# EAGLE design Warmie Helper Board V.9 (EAGLE 6.4)
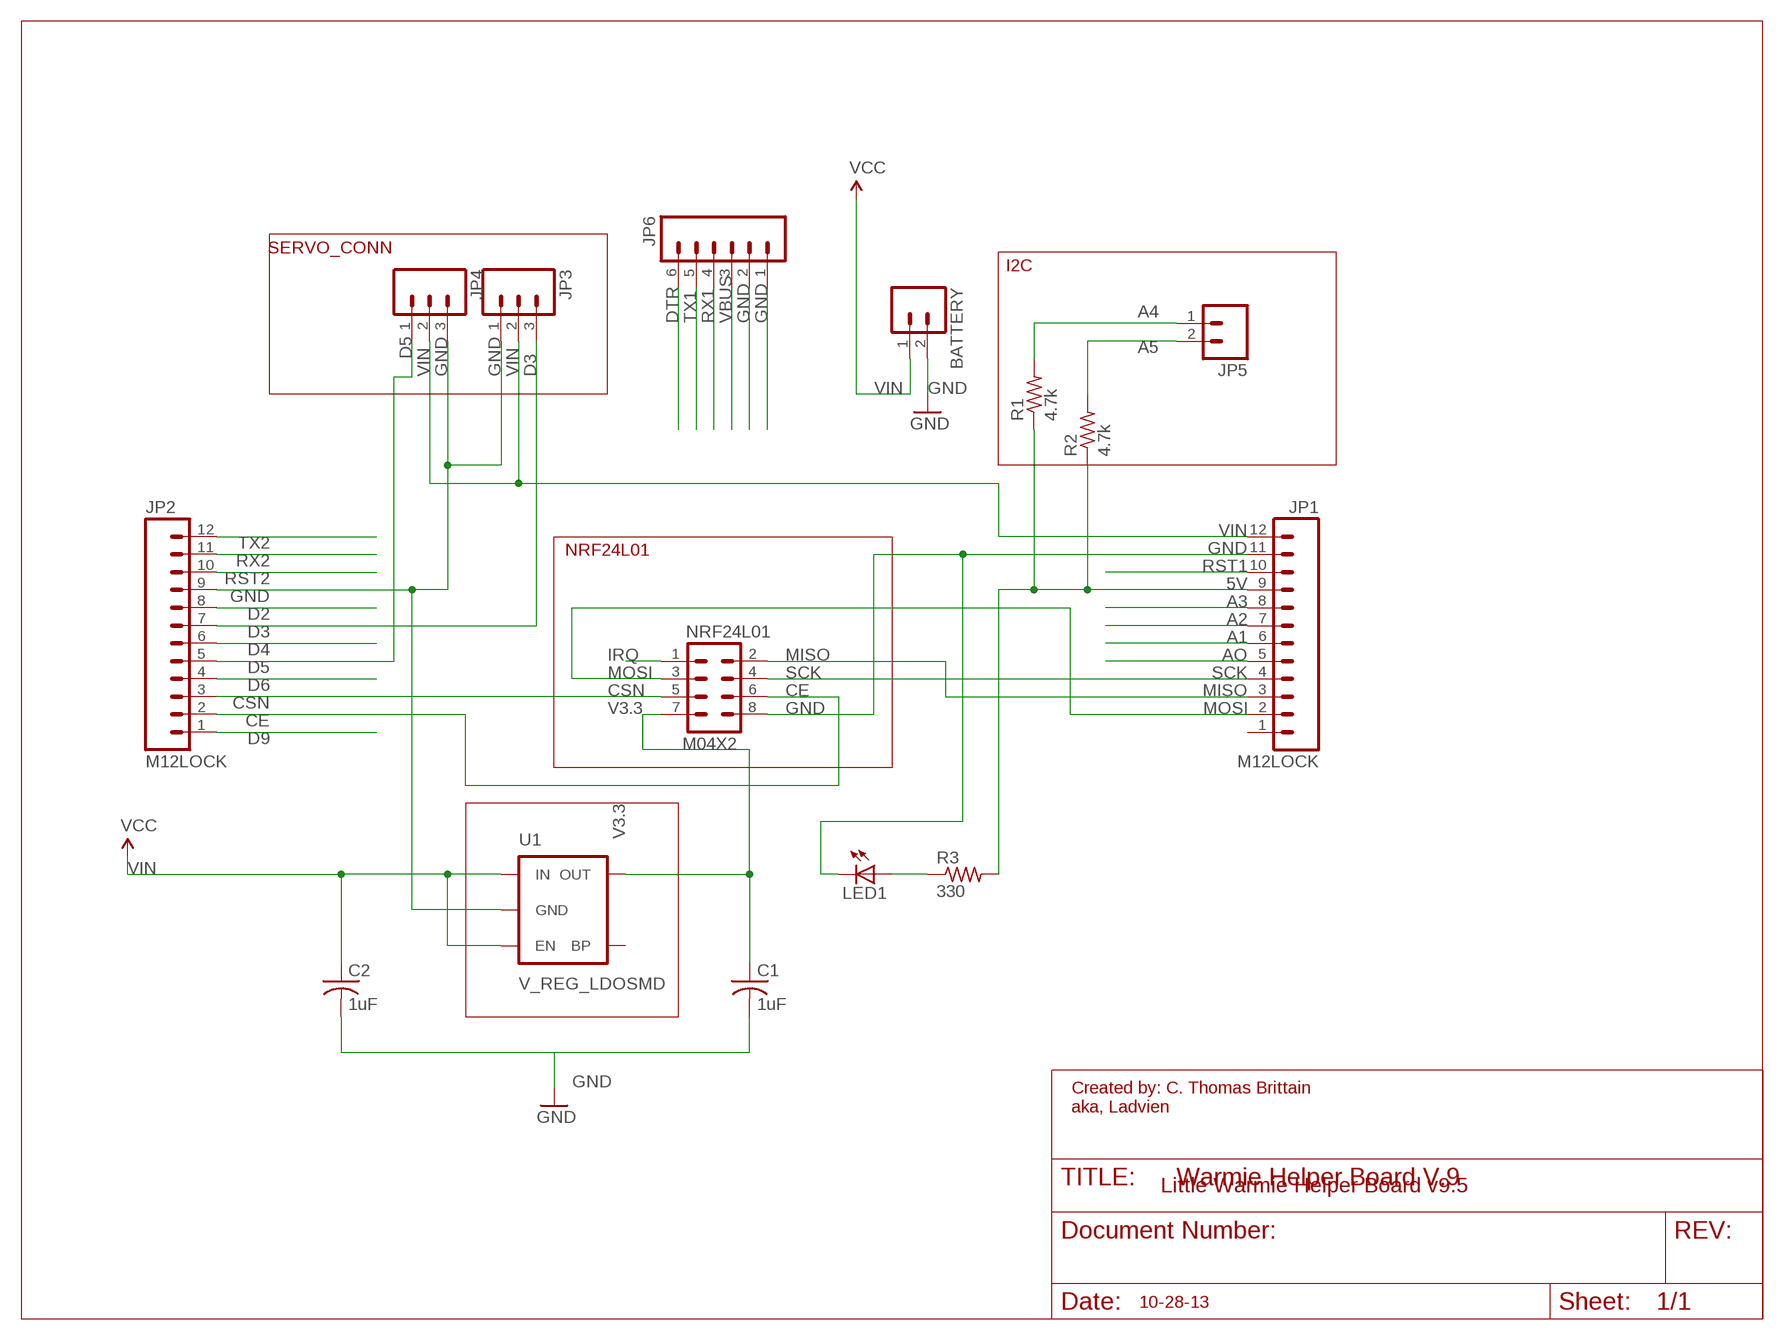
[diagram p0: schematic, sheet 1]

## Parts
BATTERY  M02LOCK  [1X02_LOCK]
C1  1uF  C-USC0805  [C0805]
C2  1uF  C-USC0805  [C0805]
JP1  M12LOCK  [1X12_LOCK]
JP2  M12LOCK  [1X12_LOCK]
JP3  M03LOCK  [1X03_LOCK]
JP4  M03LOCK  [1X03_LOCK]
JP5  M02LOCK  [1X02_LOCK]
JP6  M06LOCK  [1X06_LOCK]
LED1  LEDSML0603  [SML0603]
NRF24L01  M04X2  [2X4]
R1  4.7k  R-US_M0805  [M0805]
R2  4.7k  R-US_M0805  [M0805]
R3  330  R-US_M0805  [M0805]
U1  V_REG_LDOSMD  [SOT23-5]

## Nets
5V: JP1.9 R1.1 R2.1 R3.2
A1: JP1.6
A2: JP1.7
A3: JP1.8
A4: JP5.1 R1.2
A5: JP5.2 R2.2
AO: JP1.5
CE: JP2.2 NRF24L01.6
CSN: JP2.3 NRF24L01.5
D2: JP2.8
D3: JP2.7 JP3.3
D4: JP2.6
D5: JP2.5 JP4.1
D6: JP2.4
D9: JP2.1
DTR: JP6.6
GND: BATTERY.2 C1.2 C2.2 JP1.11 JP2.9 JP3.1 JP4.3 JP6.1 JP6.2 LED1.C NRF24L01.8 U1.2(GND)
IRQ: NRF24L01.1
MISO: JP1.3 NRF24L01.2
MOSI: JP1.2 NRF24L01.3
N$2: LED1.A R3.1
RST1: JP1.10
RST2: JP2.10
RX1: JP6.4
RX2: JP2.11
SCK: JP1.4 NRF24L01.4
TX1: JP6.5
TX2: JP2.12
V3.3: C1.1 NRF24L01.7 U1.5(OUT)
VBUS: JP6.3
VIN: BATTERY.1 C2.1 JP1.12 JP3.2 JP4.2 U1.1(IN) U1.3(EN) ; supply symbol labelled VCC
Unconnected: JP1.1 U1.4(BP)

## Notes on the sheet
- SERVO_CONN
- I2C
- NRF24L01
- Created by: C. Thomas Brittain
  aka, Ladvien
- Little Warmie Helper Board v9.5
- 10-28-13

## Library data of the parts
BATTERY JP5 = SparkFun:M02: Header 2 Standard 2-pin 0.1" header. Use with straight break away headers (SKU : PRT-00116), right angle break away headers (PRT-00553), swiss pins (PRT-00743), machine pins (PRT-00117), and female headers (PRT-00115). Molex polarized connector foot print use with SKU : PRT-08233 with associated crimp pins and housings.
C1 C2 = resistor:C-US: CAPACITOR, American symbol
JP1 JP2 = SparkFun:M12: Header 12 Standard 12-pin 0.1" header. Use with straight break away headers (SKU : PRT-00116), right angle break away headers (PRT-00553), swiss pins (PRT-00743), machine pins (PRT-00117), and female headers (PRT-00115).
JP3 JP4 = SparkFun:M03: Header 3 Standard 3-pin 0.1" header. Use with straight break away headers (SKU : PRT-00116), right angle break away headers (PRT-00553), swiss pins (PRT-00743), machine pins (PRT-00117), and female headers (PRT-00115). Molex polarized connector foot print use with SKU : PRT-08232 with associated crimp pins and housings.
JP6 = SparkFun:M06: Header 6 Standard 6-pin 0.1" header. Use with straight break away headers (SKU : PRT-00116), right angle break away headers (PRT-00553), swiss pins (PRT-00743), machine pins (PRT-00117), and female headers (PRT-00115). Molex polarized connector foot print use with SKU : PRT-08094 with associated crimp pins and housings. NOTES ON THE VARIANTS LOCK and LOCK_LONGPADS... This footprint was designed to help hold the alignment of a through-hole component (i.e. 6-pin header) while soldering it into place. You may notice that each hole has been shifted either up or down by 0.005 of an inch from it's more standard position (which is a perfectly straight line). This slight alteration caused the pins (the squares in the middle) to touch the edges of the holes. Because they are alternating, it causes a "brace" to hold the component in place. 0.005 has proven to be the perfect amount of "off-center" position when using our standard breakaway headers. Although looks a little odd when you look at the bare footprint, once you have a header in there, the alteration is very hard to notice. Also, if you push a header all the way into place, it is covered up entirely on the bottom side. This idea of altering the position of holes to aid alignment will be further integrated into the Sparkfun Library for other footprints. It can help hold any component with 3 or more connection pins.
LED1 = led:LED: LED OSRAM: - CHIPLED LG R971, LG N971, LY N971, LG Q971, LY Q971, LO R971, LY R971 LH N974, LH R974 LS Q976, LO Q976, LY Q976 LO Q996 - Hyper CHIPLED LW Q18S LB Q993, LB Q99A, LB R99A - SideLED LS A670, LO A670, LY A670, LG A670, LP A670 LB A673, LV A673, LT A673, LW A673 LH A674 LY A675 LS A676, LA A676, LO A676, LY A676, LW A676 LS A679, LY A679, LG A679 - Hyper Micro SIDELED® LS Y876, LA Y876, LO Y876, LY Y876 LT Y87S - SmartLED LW L88C, LW L88S LB L89C, LB L89S, LG L890 LS L89K, LO L89K, LY L89K LS L896, LA L896, LO L896, LY L896 - TOPLED LS T670, LO T670, LY T670, LG T670, LP T670 LSG T670, LSP T670, LSY T670, LOP T670, LYG T670 LG T671, LOG T671, LSG T671 LB T673, LV T673, LT T673, LW T673 LH T674 LS T676, LA T676, LO T676, LY T676, LB T676, LH T676, LSB T676, LW T676 LB T67C, LV T67C, LT T67C, LS T67K, LO T67K, LY T67K, LW E67C LS E67B, LA E67B, LO E67B, LY E67B, LB E67C, LV E67C, LT E67C LW T67C LS T679, LY T679, LG T679 LS T770, LO T770, LY T770, LG T770, LP T770 LB T773, LV T773, LT T773, LW T773 LH T774 LS E675, LA E675, LY E675, LS T675 LS T776, LA T776, LO T776, LY T776, LB T776 LHGB T686 LT T68C, LB T68C - Hyper Mini TOPLED® LB M676 - Mini TOPLED Santana® LG M470 LS M47K, LO M47K, LY M47K Source: http://www.osram.convergy.de LUXEON: - LUMILED® LXK2-PW12-R00, LXK2-PW12-S00, LXK2-PW14-U00, LXK2-PW14-V00 LXK2-PM12-R00, LXK2-PM12-S00, LXK2-PM14-U00 LXK2-PE12-Q00, LXK2-PE12-R00, LXK2-PE12-S00, LXK2-PE14-T00, LXK2-PE14-U00 LXK2-PB12-K00, LXK2-PB12-L00, LXK2-PB12-M00, LXK2-PB14-N00, LXK2-PB14-P00, LXK2-PB14-Q00 LXK2-PR12-L00, LXK2-PR12-M00, LXK2-PR14-Q00, LXK2-PR14-R00 LXK2-PD12-Q00, LXK2-PD12-R00, LXK2-PD12-S00 LXK2-PH12-R00, LXK2-PH12-S00 LXK2-PL12-P00, LXK2-PL12-Q00, LXK2-PL12-R00 Source: www.luxeon.com KINGBRIGHT: KA-3528ASYC Source: www.kingbright.com
NRF24L01 = SparkFun:M04X2
R1-R3 = resistor:R-US_: RESISTOR, American symbol
U1 = SparkFun:V_REG_LDO: Voltage Regulator LDO Standard 150mA LDO voltage regulator in SOT-23 layout. Micrel part MIC5205. BP (by-pass) pin is used to lower output noise with 470pF cap.

## Board
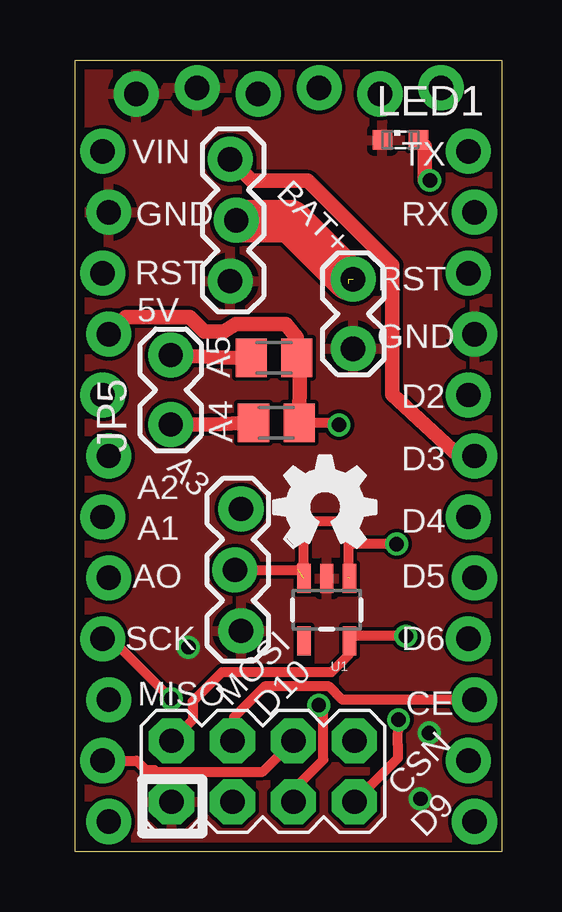
[diagram p1: board, top side]
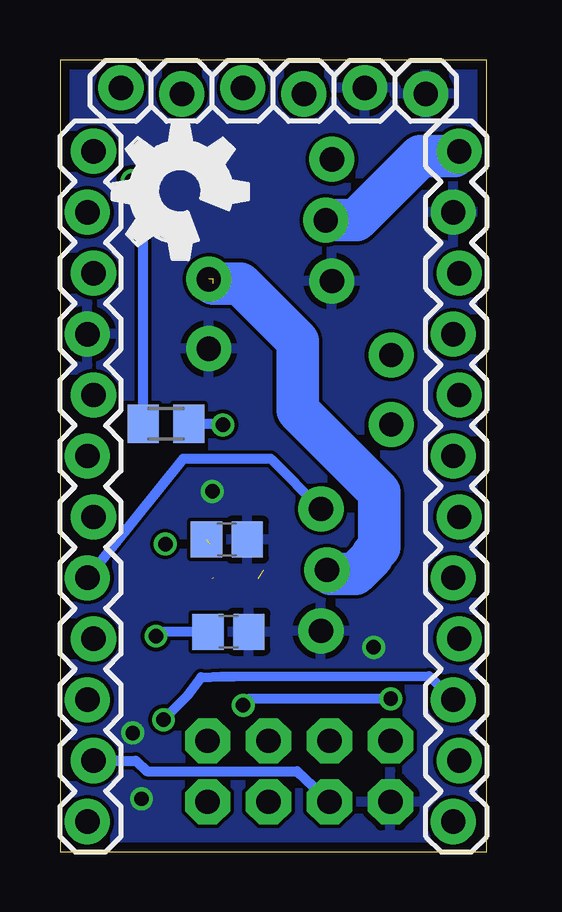
[diagram p2: board, bottom side, seen from below]

Size 17.78 x 33.02 mm. Coordinates in mm from the lower left corner, seen from the top.
Outline: 17.78,0 0,0 0,33.02 17.78,33.02 17.78,0
Copper layers (1*16): Top 0.0356mm / dielectric 1.25mm / Bottom 0.0356mm
Design rules "LaenPCBOrder *": minimum track width 6mil, minimum drill 13mil, track to track 6mil, track to pad 6mil, pad to pad 6mil, via to via 6mil, smd to smd 6mil, copper to edge 15mil, drill to drill 6mil, minimum pad ring 7mil, minimum via ring 7mil, stop-mask expansion 4mil, vias tented up to drill 0mil, thermal gap 10mil

### Footprints (pad centres in the part's own frame; a part is rotated, then mirrored left to right if it is on the bottom)
1X02_LOCK = drill 1.016 pad 1.88: 1 -0.178,0; 2 2.718,0
C0805 = smd 1.3 x 1.5: 1 -0.85,0; 2 0.85,0
1X12_LOCK = drill 1.016 pad 1.88: 1 0,0.127; 2 2.54,-0.127; 3 5.08,0.127; 4 7.62,-0.127; 5 10.16,0.127; 6 12.7,-0.127; 7 15.24,0.127; 8 17.78,-0.127; 9 20.32,0.127; 10 22.86,-0.127; 11 25.4,0.127; 12 27.94,-0.127
1X03_LOCK = drill 1.016 pad 1.88: 1 0,0.127; 2 2.54,-0.127; 3 5.08,0.127
1X06_LOCK = drill 1.016 pad 1.88: 1 0,0; 2 2.54,-0.254; 3 5.08,0; 4 7.62,-0.254; 5 10.16,0; 6 12.7,-0.254
SML0603 = smd 0.8 x 0.8: A 0.75,0; C -0.75,0
2X4 = drill 1.016 pad 1.88 octagon: 1 -3.81,-1.27; 2 -3.81,1.27; 3 -1.27,-1.27; 4 -1.27,1.27; 5 1.27,-1.27; 6 1.27,1.27; 7 3.81,-1.27; 8 3.81,1.27
M0805 = smd 1.3 x 1.6: 1 -0.95,0; 2 0.95,0
SOT23-5 = smd 0.55 x 1.2: 1 -0.95,-1.3; 2 0,-1.3; 3 0.95,-1.3; 4 0.95,1.3; 5 -0.95,1.3

### Placement (x,y rotation side)
BATTERY  11.58,23.7 270 top
C1  10.76,9.18 0 bottom
C2  10.83,13.03 0 bottom
JP1  1.27,1.27 90 bottom
JP2  16.51,1.27 90 bottom
JP3  6.58,23.8 90 top
JP4  6.78,14.3 270 top
JP5  3.98,18 90 top
JP6  2.54,31.6 180 bottom
LED1  13.55,29.69 0 top
NRF24L01  7.82,3.36 180 top
R1  8.38,17.9 180 top
R2  8.28,20.6 180 top
R3  13.36,17.86 0 bottom
U1  10.48,10.1 180 top
U$2  [OSHW_FILLX200_NOTEXT]  13.18,23.94 45 bottom
U$3  [OSHW_FILLX150_NOTEXT]  8.28,12.7 0 top

### Tracks (layer width: path | path; a pad name or v marks a point on that pad's centre or on a via)
5V  (via drill 0.6)
  Top 0.406: R1.1 10.9,17.9 v10.99,17.81
  Top 0.61: R1.1 9.35,19.87 R2.1 9.23,21.45 8.78,22 6.68,22 6.18,21.7 5.38,21.7 4.78,22.3 2.11,22.3 JP1.9
  Bottom 0.406: R3.2 11.04,17.86 v10.99,17.81
A4
  Top 0.61: JP5.1 5.61,17.82 R1.2
A5
  Top 0.61: JP5.2 6.21,20.62 R2.2
CE
  Bottom 0.406: JP2.2 15.39,3.81 14.63,3.81 14.17,3.37 7.91,3.37 NRF24L01.6
CSN
  Top 0.406: JP2.3 11.13,6.35 10.58,6.9 7.89,6.9 6.61,5.62 6.61,4.69 NRF24L01.5
D3
  Top 0.61: JP2.7 15.97,16.51 13.21,19.07 13.21,24.46 9.69,27.98 7.35,27.98 JP3.3
D5
  Bottom 0.406: JP2.5 12.65,16.4 9,16.4 JP4.1
GND  (via drill 0.6)
  other vias: 14.75,4.96 14.38,2.22 4.72,8.53 11.43,15.04
  pour Top: -0.22,0 -0.22,33 17.78,33 17.78,0
  pour Bottom: -0.22,0 -0.22,33 17.78,33 17.78,0
MISO  (via drill 0.6)
  Top 0.406: v13.47,5.52 13.44,4.46 13.44,3.91 NRF24L01.2
  Bottom 0.406: JP1.3 2.4,7.34 10.52,7.32 11.05,7.32 11.9,7.29 12.48,6.5 v13.47,5.52
MOSI
  Top 0.406: JP1.2 2.56,3.81 2.95,3.42 3.3,3.42 3.38,3.35 7.81,3.35 NRF24L01.3
N$2  (via drill 0.6)
  Top 0.406: v14.78,28 14.56,28
  Top 0.61: 14.56,28 14.56,29.43 LED1.A
  Bottom 0.406: R3.1 14.31,27.53 v14.78,28
SCK  (via drill 0.6)
  Top 0.406: NRF24L01.4 9.09,2.6 10.34,3.85 10.34,5.92 v10.15,6.12 | JP1.4 1.5,8.89 v4,6.39
  Bottom 0.406: 10.13,6.1 v10.15,6.12 9.88,6.39 v4,6.39
V3.3  (via drill 0.6)
  Top 0.406: v13.78,9 11.63,9 U1.5 11.38,8.75 11.38,8.2 10.68,7.5 6.12,7.5 4.89,6.27 4.89,5.51 NRF24L01.7
  Bottom 0.406: C1.1 13.6,9.18 v13.78,9
VIN  (via drill 0.6)  (5 unrouted)
  Top 0.406: 11.38,13 11.38,13.7 11.28,13.8 9.88,13.8 9.53,13.45 9.53,12 9.29,11.76 JP4.2 | 11.38,13 11.38,11.45 | v13.39,12.84 11.54,12.84 11.38,13
  Top 1.778: 11.4,23.88 8.98,26.3 6.75,26.3 JP3.2
  Bottom 0.406: 13.2,13.03 v13.39,12.84
  Bottom 1.778: JP4.2 6.49,11.6 5.48,11.6 4.78,12.3 4.78,12.4 4.48,12.7 4.48,15 7.88,18.4 7.88,21.3 10.28,23.7 11.4,23.7 | JP3.2 5.44,26.34 2.78,29 1.35,29 JP1.12

### Text on the board
_tsilk: VIN | TX | GND | BAT+ | RX | RST | RST | 5V | GND | A5 | D2 | A4 | D3 | A2 | A3 | A1 | D4 | AO | D5 | SCK | D6 | MISO | MOSI | D10 | CE | CSN | D9
_bsilk: GND | DTR | RX | TX | GND | VBUS | Little Swamie Helper v.9.2 / C. Thomas Brittain | NRF24L01